# EAGLE design Control_Board_V2 (EAGLE 9.5.2)
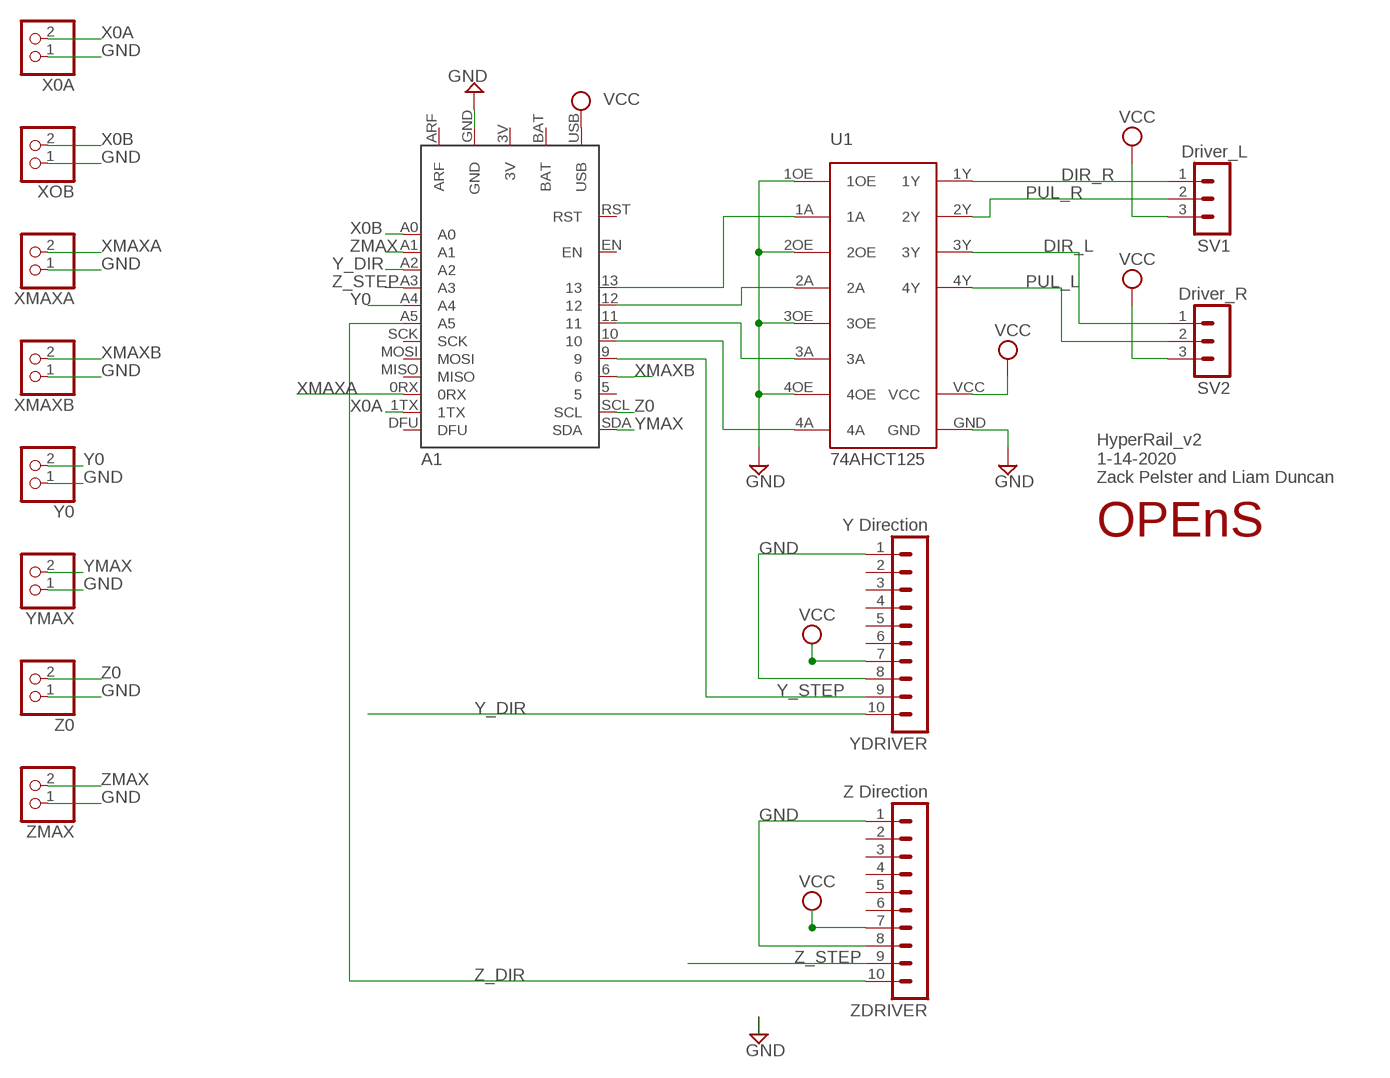
[diagram p0: schematic, sheet 1]

## Parts
A1  FEATHER_BLUEFRUIT_M0  [FEATHER_BLUEFRUIT_M0]
SV1  Driver_L  MA03-1  [MA03-1]
SV2  Driver_R  MA03-1  [MA03-1]
U1  74AHCT125  [74AHCT125]
U$1  OPENS-LOGO  [OPENS-LOGO]
X0A  PINHD-1X2  [1X02]
XMAXA  PINHD-1X2  [1X02]
XMAXB  PINHD-1X2  [1X02]
XOB  PINHD-1X2  [1X02]
Y0  PINHD-1X2  [1X02]
YDRIVER  Y Direction  MA10-1  [MA10-1]
YMAX  PINHD-1X2  [1X02]
Z0  PINHD-1X2  [1X02]
ZDRIVER  Z Direction  MA10-1  [MA10-1]
ZMAX  PINHD-1X2  [1X02]

## Nets
DIR_L: SV2.1 U1.3Y
DIR_R: SV1.1 U1.1Y
GND: A1.GND U1.1OE U1.2OE U1.3OE U1.4OE U1.GND X0A.1 XMAXA.1 XMAXB.1 XOB.1 Y0.1 YDRIVER.1 YDRIVER.8 YMAX.1 Z0.1 ZDRIVER.1 ZDRIVER.8 ZMAX.1
N$2: A1.13 U1.1A
N$3: A1.12 U1.2A
N$4: A1.11 U1.3A
N$5: A1.10 U1.4A
PUL_L: SV2.2 U1.4Y
PUL_R: SV1.2 U1.2Y
VCC: A1.USB SV1.3 SV2.3 U1.VCC YDRIVER.7 ZDRIVER.7
X0A: A1.1TX X0A.2
X0B: A1.A0 XOB.2
XMAXA: A1.0RX XMAXA.2
XMAXB: A1.6 XMAXB.2
Y0: A1.A4 Y0.2
Y_DIR: A1.A2 YDRIVER.10
Y_STEP: A1.9 YDRIVER.9
YMAX: A1.SDA YMAX.2
Z0: A1.SCL Z0.2
Z_DIR: A1.A5 ZDRIVER.10
Z_STEP: A1.A3 ZDRIVER.9
ZMAX: A1.A1 ZMAX.2
Unconnected: A1.5 A1.ARF A1.DFU A1.EN A1.MISO A1.MOSI A1.RST A1.SCK YDRIVER.2 YDRIVER.3 YDRIVER.4 YDRIVER.5 YDRIVER.6 ZDRIVER.2 ZDRIVER.3 ZDRIVER.4 ZDRIVER.5 ZDRIVER.6

## Notes on the sheet
- HyperRail_v2
  1-14-2020
  Zack Pelster and Liam Duncan

## Power pins joined to a net without a drawn wire
3V: A1.3V
BAT: A1.BAT

## Library data of the parts
A1 = Feather Bluefruit M0:FEATHER_BLUEFRUIT_M0
SV1 SV2 = con-lstb:MA03-1: PIN HEADER; OC_FARNELL: unknown; OC_NEWARK: unknown
U1 = HyperRail:74AHCT125
U$1 = opens-logo:OPENS-LOGO: OPENS Lab Logo
X0A XMAXA XMAXB XOB Y0 YMAX Z0 ZMAX = pinhead:PINHD-1X2: PIN HEADER
YDRIVER ZDRIVER = con-lstb:MA10-1: PIN HEADER; OC_FARNELL: unknown; OC_NEWARK: unknown

## Board
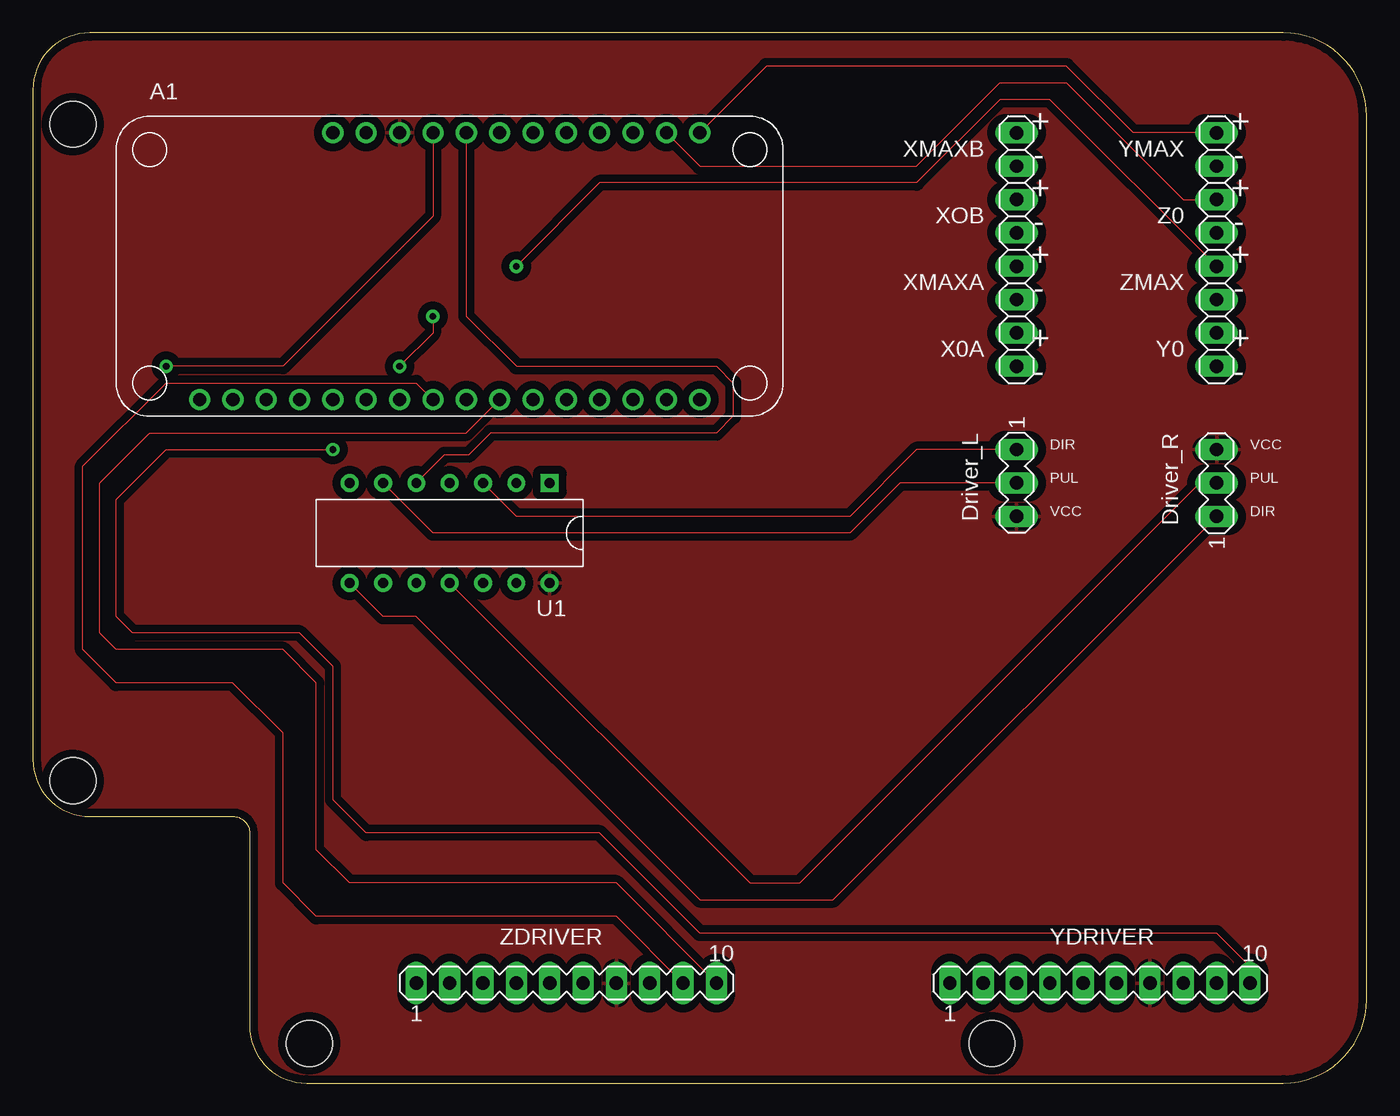
[diagram p1: board, top side]
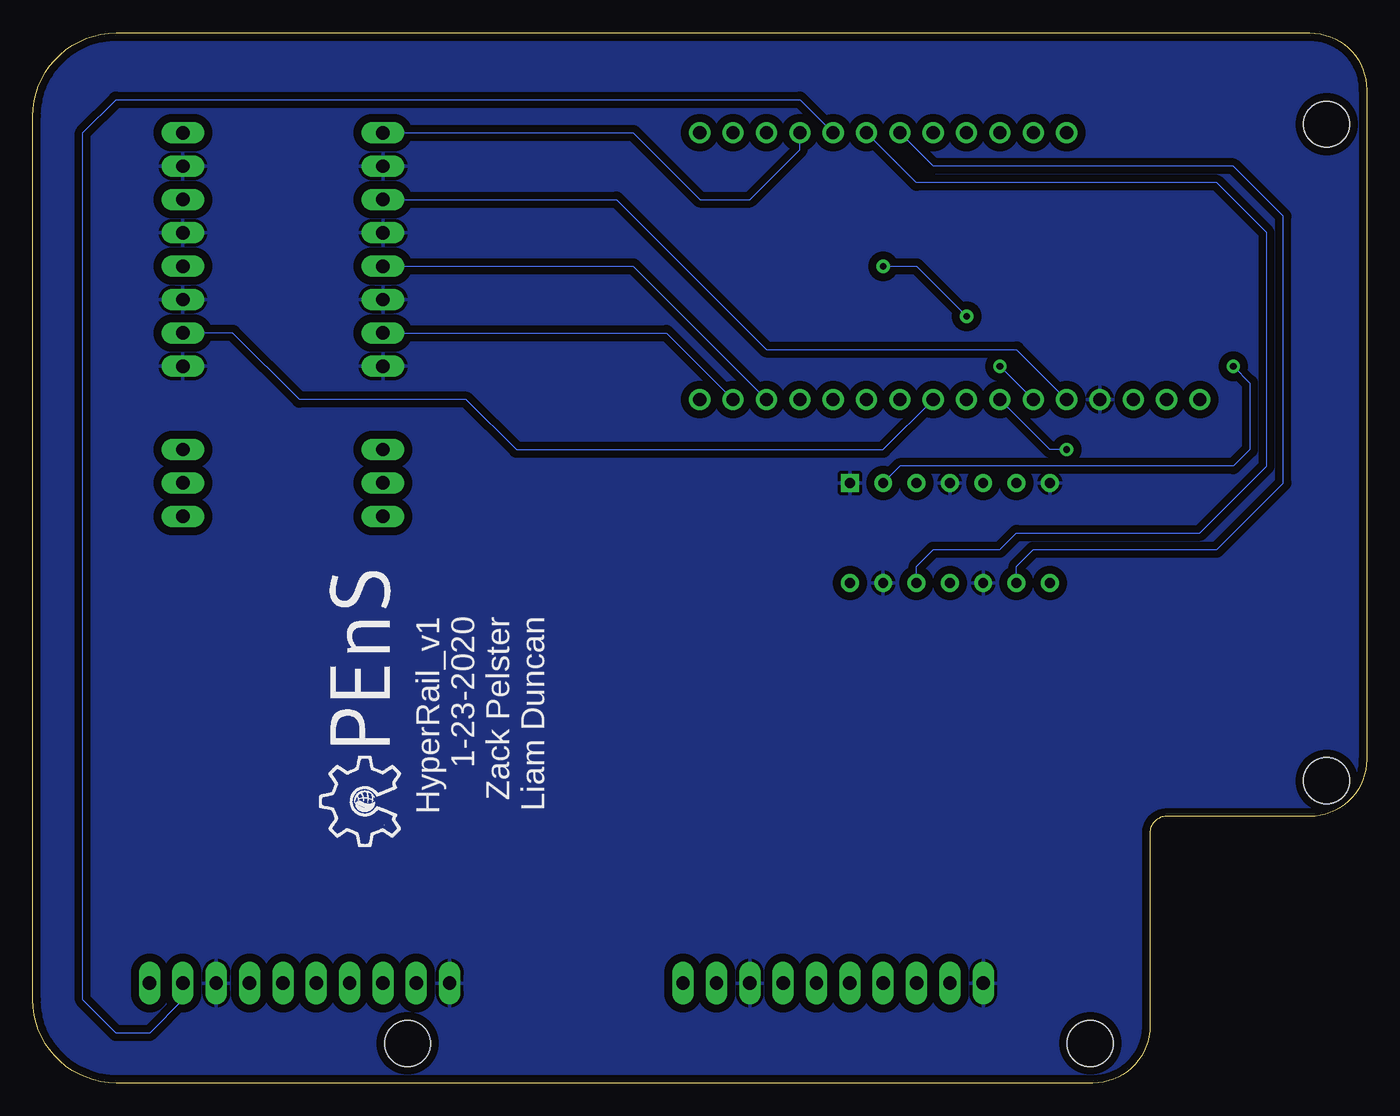
[diagram p2: board, bottom side, seen from below]

Size 101.6 x 80.01 mm. Coordinates in mm from the lower left corner, seen from the top.
Outline: 20.85,0 95.25,0 arc90 101.6,6.35 101.6,73.66 arc90 95.25,80.01 4.34,80.01 arc90 0,75.67 0,24.66 arc90 4.34,20.32 15.24,20.32 arc-90 16.51,19.05 16.51,4.34 arc90 20.85,0
Copper layers (1*16): Top 0.035mm / dielectric 1.5mm / Bottom 0.035mm
Design rules "SparkFun *": minimum track width 8mil, minimum drill 20mil, track to track 8mil, track to pad 8mil, pad to pad 8mil, via to via 8mil, smd to smd 8mil, copper to edge 8mil, drill to drill 8mil, minimum pad ring 12mil, minimum via ring 10mil, stop-mask expansion 4mil, vias tented up to drill 30mil, thermal gap 10mil
Holes 3.5 mm at 21.06,3.02 3.05,23.04 3.05,73.05 73.05,3.02

### Footprints (pad centres in the part's own frame; a part is rotated, then mirrored left to right if it is on the bottom)
FEATHER_BLUEFRUIT_M0 = drill 1: 0RX 39.37,1.27; 1TX 41.91,1.27; 3V 8.89,1.27; 5 39.37,21.59; 6 36.83,21.59; 9 34.29,21.59; 10 31.75,21.59; 11 29.21,21.59; 12 26.67,21.59; 13 24.13,21.59; A0 16.51,1.27; A1 19.05,1.27; A2 21.59,1.27; A3 24.13,1.27; A4 26.67,1.27; A5 29.21,1.27; ARF 11.43,1.27; BAT 16.51,21.59; DFU 44.45,1.27; EN 19.05,21.59; GND 13.97,1.27; MISO 36.83,1.27; MOSI 34.29,1.27; RST 6.35,1.27; SCK 31.75,1.27; SCL 41.91,21.59; SDA 44.45,21.59; USB 21.59,21.59
MA03-1 = drill 1.016 long: 1 -2.54,0; 2 0,0; 3 2.54,0
74AHCT125 = drill 0.75: 1A 5.08,0; 1Y 7.62,0; 2A 12.7,0; 2OE 10.16,0; 2Y 15.24,0; 3A 15.24,7.62; 3OE 12.7,7.62; 3Y 17.78,7.62; 4A 7.62,7.62; 4OE 5.08,7.62; 4Y 10.16,7.62; GND 17.78,0; VCC 2.54,7.62 | drill 0.75 square: 1OE 2.54,0
1X02 = drill 1.016 long: 1 -1.27,0; 2 1.27,0
MA10-1 = drill 1.016 long: 1 -11.43,0; 2 -8.89,0; 3 -6.35,0; 4 -3.81,0; 5 -1.27,0; 6 1.27,0; 7 3.81,0; 8 6.35,0; 9 8.89,0; 10 11.43,0

### Placement (x,y rotation side)
A1  6.35,50.8 0 top
SV1  74.93,45.72 270 top
SV2  90.17,45.72 90 top
U1  41.91,45.72 180 top
U$1  69.85,17.78 90 bottom
X0A  74.93,55.88 90 top
XMAXA  74.93,60.96 90 top
XMAXB  74.93,71.12 90 top
XOB  74.93,66.04 90 top
Y0  90.17,55.88 90 top
YDRIVER  81.28,7.62 0 top
YMAX  90.17,71.12 90 top
Z0  90.17,66.04 90 top
ZDRIVER  40.64,7.62 0 top
ZMAX  90.17,60.96 90 top

### Tracks (layer width: path | path; a pad name or v marks a point on that pad's centre or on a via)
DIR_L
  Top 0.012: U1.3Y 26.67,35.56 29.21,35.56 50.8,13.97 60.96,13.97 SV2.1
DIR_R
  Top 0.012: U1.1Y 36.83,43.18 62.23,43.18 67.31,48.26 SV1.1
GND
  pour Bottom (isolate 0.61): 115.57,0 115.57,85.09 -30.48,85.09 -30.48,0
N$2  (via drill 0.51)
  Top 0.012: A1.13 30.48,66.04 19.05,54.61 v10.16,54.61
  Bottom 0.012: v10.16,54.61 8.89,53.34 8.89,48.26 10.16,46.99 35.56,46.99 U1.1A
N$3
  Top 0.012: A1.12 33.02,58.42 36.83,54.61 52.07,54.61 53.34,53.34 53.34,50.8 52.07,49.53 34.87,49.53 33.19,47.85 31.34,47.85 U1.2A
N$4
  Bottom 0.012: U1.3A 26.67,39.37 25.4,40.64 11.43,40.64 6.35,45.72 6.35,66.04 10.16,69.85 33.02,69.85 A1.11
N$5
  Bottom 0.012: U1.4A 34.29,39.37 33.02,40.64 27.94,40.64 26.67,41.91 12.7,41.91 7.62,46.99 7.62,64.77 11.43,68.58 34.29,68.58 A1.10
PUL_L
  Top 0.012: U1.4Y 54.61,15.24 58.42,15.24 88.9,45.72 SV2.2
PUL_R
  Top 0.012: SV1.2 66.04,45.72 62.23,41.91 30.48,41.91 U1.2Y
VCC
  pour Top (isolate 0.61): 107.95,81.28 107.95,-3.81 -16.51,-3.81 -16.51,81.28
X0A
  Bottom 0.012: A1.1TX 53.34,57.15 X0A.2
X0B
  Bottom 0.012: XOB.2 57.15,67.31 45.72,55.88 26.67,55.88 A1.A0
XMAXA
  Bottom 0.012: A1.0RX 55.88,62.23 XMAXA.2
XMAXB
  Bottom 0.012: A1.6 43.18,71.12 46.99,67.31 50.8,67.31 55.88,72.39 XMAXB.2
Y0
  Bottom 0.012: Y0.2 86.36,57.15 81.28,52.07 68.58,52.07 64.77,48.26 36.83,48.26 A1.A4
Y_DIR  (via drill 0.51)
  Top 0.012: YDRIVER.10 92.71,8.89 90.17,11.43 50.8,11.43 43.18,19.05 25.4,19.05 22.86,21.59 22.86,31.75 20.32,34.29 7.62,34.29 6.35,35.56 6.35,44.45 10.16,48.26 v22.86,48.26
  Bottom 0.012: v22.86,48.26 24.13,48.26 A1.A2
Y_STEP
  Bottom 0.012: A1.9 43.18,74.93 95.25,74.93 97.79,72.39 97.79,6.35 95.25,3.81 92.71,3.81 90.17,6.35 YDRIVER.9
YMAX
  Top 0.012: YMAX.2 83.82,72.39 78.74,77.47 55.88,77.47 A1.SDA
Z0
  Top 0.012: A1.SCL 50.8,69.85 67.31,69.85 73.66,76.2 78.74,76.2 87.63,67.31 Z0.2
Z_DIR
  Top 0.012: ZDRIVER.10 44.45,15.24 24.13,15.24 21.59,17.78 21.59,30.48 19.05,33.02 6.35,33.02 5.08,34.29 5.08,45.72 8.89,49.53 33.02,49.53 A1.A5
Z_STEP
  Top 0.012: ZDRIVER.9 44.45,12.7 21.59,12.7 19.05,15.24 19.05,26.67 15.24,30.48 6.35,30.48 3.81,33.02 3.81,46.99 10.16,53.34 29.21,53.34 A1.A3
ZMAX  (via drill 0.51)
  Top 0.012: ZMAX.2 77.47,74.93 73.66,74.93 67.31,68.58 43.18,68.58 v36.83,62.23 | v30.48,58.42 30.48,57.15 v27.94,54.61
  Bottom 0.012: v36.83,62.23 34.29,62.23 v30.48,58.42 | v27.94,54.61 A1.A1

### Text on the board
bPlace: HyperRail_v1 / 1-23-2020 / Zack Pelster / Liam Duncan
tNames: + | + | - | - | + | + | - | - | + | + | - | - | + | + | - | - | DIR | VCC | PUL | PUL | VCC | DIR